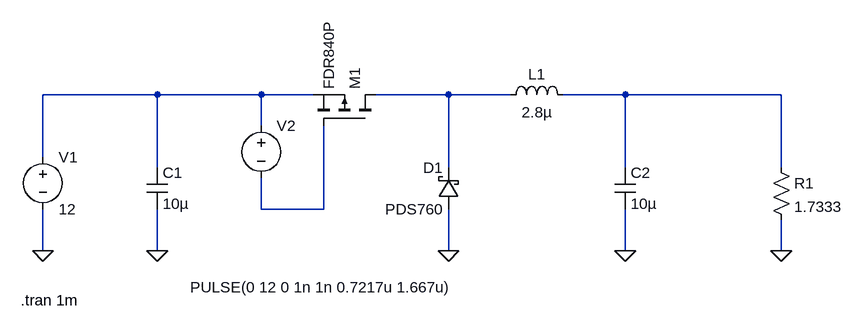
[diagram p0: schematic 5V2 Plant.asc]
5V2 Plant.asc, the LTspice schematic file:
Version 4
SHEET 1 1144 680
WIRE 80 -16 -96 -16
WIRE 240 -16 80 -16
WIRE 320 -16 240 -16
WIRE 528 -16 416 -16
WIRE 624 -16 528 -16
WIRE 800 -16 704 -16
WIRE 1040 -16 800 -16
WIRE 240 32 240 -16
WIRE -96 80 -96 -16
WIRE 80 96 80 -16
WIRE 528 96 528 -16
WIRE 800 96 800 -16
WIRE 1040 96 1040 -16
WIRE 240 160 240 112
WIRE 336 160 336 32
WIRE 336 160 240 160
WIRE -96 224 -96 160
WIRE 80 224 80 160
WIRE 528 224 528 160
WIRE 800 224 800 160
WIRE 1040 224 1040 176
FLAG -96 224 0
FLAG 80 224 0
FLAG 528 224 0
FLAG 800 224 0
FLAG 1040 224 0
SYMBOL voltage -96 64 R0
WINDOW 123 0 0 Left 0
WINDOW 39 0 0 Left 0
SYMATTR InstName V1
SYMATTR Value 12
SYMBOL voltage 240 16 R0
WINDOW 3 -109 264 Left 2
WINDOW 123 0 0 Left 0
WINDOW 39 0 0 Left 0
SYMATTR InstName V2
SYMATTR Value PULSE(0 12 0 1n 1n 0.7217u 1.667u)
SYMBOL pmos 416 32 M270
SYMATTR InstName M1
SYMATTR Value FDR840P
SYMBOL schottky 544 160 R180
WINDOW 0 24 64 Left 2
WINDOW 3 24 0 Left 2
SYMATTR InstName D1
SYMATTR Value PDS760
SYMATTR Description Diode
SYMATTR Type diode
SYMBOL cap 64 96 R0
SYMATTR InstName C1
SYMATTR Value 10µ
SYMBOL cap 784 96 R0
SYMATTR InstName C2
SYMATTR Value 10µ
SYMBOL ind 608 0 R270
WINDOW 0 32 56 VTop 2
WINDOW 3 5 56 VBottom 2
SYMATTR InstName L1
SYMATTR Value 2.8µ
SYMBOL res 1024 80 R0
SYMATTR InstName R1
SYMATTR Value 1.7333
TEXT -130 300 Left 2 !.tran 1m

The netlist it stands for:
* 5V2 Plant.asc
V1 N001 0 12
V2 N001 N004 PULSE(0 12 0 1n 1n 0.7217u 1.667u)
M1 N002 N004 N001 N001 FDR840P
D1 0 N002 PDS760
C1 N001 0 10µ
C2 N003 0 10µ
L1 N002 N003 2.8µ
R1 N003 0 1.7333
.model D D
.lib standard.dio
.model NMOS NMOS
.model PMOS PMOS
.lib standard.mos
.tran 1m
.backanno
.end